# Altium project Modbus-HUB.PrjPcb (part 3 of 3)
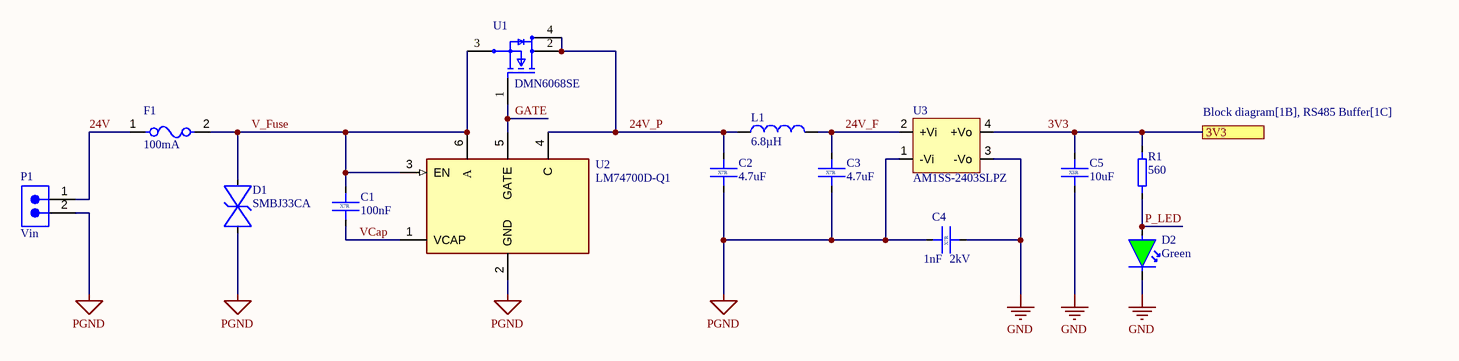
[diagram p4: PSU.SchDoc]

## Sheet PSU.SchDoc: POWER SUPPLY (continued)

### Library data of the parts (continued)
U1 = DMN6068SE-13: N-Channel 60 V 68 mOhm Surface Mount Enhancement Mode Mosfet - SOT-223-3; Manufacturer: Diodes; Package Body Material: Plastic; Transistor Element Material: SILICON; Number of Elements: 1; Time @ Peak Reflow Temperature-Max (s): 40s; Additional Feature: HIGH RELIABILITY; Avalanche Energy Rating (Eas): 37.5mJ; Case Connection: DRAIN; Drain Current-Max (Abs) (ID): 5.6A; Drain Current-Max (ID): 4.1A; Drain-source On Resistance-Max: 68mR; DS Breakdown Voltage-Min: 60V; FET Technology: METAL-OXIDE SEMICONDUCTOR; Power Dissipation-Max (Abs): 3.7W; Pulsed Drain Current-Max (IDM): 20.8A; Transistor Application: SWITCHING; JEDEC-95 Code: TO-261AA; Qualification Status: Not Qualified; Drain to Source Resistance: 68mΩ; Element Configuration: Single; Fall Time: 8.7ns; Gate to Source Voltage (Vgs): 20V; Input Capacitance: 502pF; Value: 68mΩ; Rise Time: 10.8ns; Turn-Off Delay Time: 11.9ns; Turn-On Delay Time: 3.6ns; Supplier: TME; Supplier Part Number: DMN6068SE-13; Manufacturer Part Number: DMN6068SE-13; RoHS: Yes; Category: MOSFETs; Stock: 3135; Pricing: 1=0,655, 10=0,425, 50=0,331, 100=0,291, 200=0,252, 250=0,239, 400=0,213, 500=0,2, 1000=0,161 (EUR); Pins: 4; Package Shape: Rectangular; Terminal Finish: Tin; Max Operating Temperature: 150°C; JESD-609 Code: e3; JESD-30 Code: R-PDSO-G4; Moisture Sensitivity Level: 1; Package Style: SMALL OUTLINEMeter; Peak Reflow Temperature (Cel): 260°C; Surface Mount: Yes; Terminal Form: Gull Wing; Terminal Position: DUAL; Polarity/Channel Type: N-CHANNEL; Operating Mode: ENHANCEMENT MODE; RoHS Compliant: Yes; Reach SVHC Compliant: No; ComponentLink1URL: https://datasheet.ciiva.com:443/pdfs/VipMasterIC/IC/DIOD/DIODS20377/DIODS20377-1.pdf?src-supplier=IHS+Markit; ComponentLink1Description: https://datasheet.ciiva.com:443/pdfs/VipMasterIC/IC/DIOD/DIODS20377/DIODS20377-1.pdf?src-supplier=IHS+Markit; ComponentLink2URL: https://datasheet.ciiva.com/11176/ds32033-11176546.pdf?src-supplier=Avnet; ComponentLink2Description: https://datasheet.ciiva.com/11176/ds32033-11176546.pdf?src-supplier=Avnet; ComponentLink3URL: https://datasheet.ciiva.com/935/ds32033-935232.pdf?src-supplier=Digikey; ComponentLink3Description: https://datasheet.ciiva.com/935/ds32033-935232.pdf?src-supplier=Digikey; ComponentLink4URL: https://datasheet.ciiva.com/8115/ds32033-8115611.pdf?src-supplier=Avnet; ComponentLink4Description: https://datasheet.ciiva.com/8115/ds32033-8115611.pdf?src-supplier=Avnet; Supplier 1: TME; Supplier Part Number 1: DMN6068SE-13; Case/Package: SOT-223; China RoHS: Non-Compliant; Contact Plating: Tin; Continuous Drain Current (ID): 4.1A; Drain to Source Breakdown Voltage: 60V; Drain to Source Voltage (Vdss): 60V; Height: 1.65mm; Lead Free: Lead Free; Length: 6.7mm; Lifecycle Status: Production; Max Power Dissipation: 3.7W; Min Breakdown Voltage: 60V; Min Operating Temperature: -55°C; Mounting Technology: Surface Mount; Number of Channels: 1; Number of Terminals: 4; Power Dissipation: 3.7W; Radiation Hardening: No; Rds On Max: 68mΩ; REACH SVHC: No; Schedule B: 8541290080, 8541290080|8541290080, 8541290080|8541290080|8541290080, 8541290080|8541290080|8541290080|8541290080; Weight: 7.994566mg; Width: 3.7mm; ComponentLink5URL: https://datasheet.octopart.com:443/DMN6068SE-13-Diodes-Inc.-datasheet-46751422.pdf?src-supplier=IHS; ComponentLink5Description: https://datasheet.octopart.com:443/DMN6068SE-13-Diodes-Inc.-datasheet-46751422.pdf?src-supplier=IHS; ComponentLink6URL: https://datasheet.octopart.com/DMN6068SE-13-Diodes-Inc.-datasheet-12556103.pdf; ComponentLink6Description: https://datasheet.octopart.com/DMN6068SE-13-Diodes-Inc.-datasheet-12556103.pdf; ComponentLink7URL: https://sigma.octopart.com:443/138895852/technical_drawing/Diodes-Inc.-DMN6068SE-13.pdf?src-supplier=Diodes+Inc+SCT; ComponentLink7Description: https://sigma.octopart.com:443/138895852/technical_drawing/Diodes-Inc.-DMN6068SE-13.pdf?src-supplier=Diodes+Inc+SCT; ComponentLink8URL: https://datasheet.octopart.com:443/DMN6068SE-13-Diodes-Inc.-datasheet-101745846.pdf?src-supplier=Future+Electronics; ComponentLink8Description: https://datasheet.octopart.com:443/DMN6068SE-13-Diodes-Inc.-datasheet-101745846.pdf?src-supplier=Future+Electronics; ComponentLink9URL: https://datasheet.octopart.com:443/DMN6068SE-13-Diodes-Inc.-datasheet-10884877.pdf?src-supplier=Arrow+Electronics; ComponentLink9Description: https://datasheet.octopart.com:443/DMN6068SE-13-Diodes-Inc.-datasheet-10884877.pdf?src-supplier=Arrow+Electronics; ComponentLink10URL: https://datasheet.octopart.com:443/DMN6068SE-13-Diodes-Inc.-datasheet-14188552.pdf?src-supplier=iiiC; ComponentLink10Description: https://datasheet.octopart.com:443/DMN6068SE-13-Diodes-Inc.-datasheet-14188552.pdf?src-supplier=iiiC; ComponentLink11URL: http://sigma.octopart.com:80/15540767/rohs_statement/Diodes-Inc.-DMN6068SE-13.pdf?src-supplier=Compliance+Statements; ComponentLink11Description: http://sigma.octopart.com:80/15540767/rohs_statement/Diodes-Inc.-DMN6068SE-13.pdf?src-supplier=Compliance+Statements
U2 = LM74700QDBVRQ1: Power Supply Support Circuit, Fixed, 1 Channel, PDSO6; Manufacturer: Texas Instrument; Manufacturer Part Number: LM74700QDBVRQ1; LCSC: C2941042; Supplier 1: Mouser; Supplier Part Number 1: 595-LM74700DDFEVM; Supplier: Mouser; Supplier Part Number: 595-LM74700QDBVRQ1; RoHS: Yes; Category: Power Management ICs; Stock: 15340; Throw Configuration: POWER SUPPLY SUPPORT CIRCUIT; RoHS Compliant: Yes; Reach SVHC Compliant: Yes; ComponentLink1URL: https://www.ti.com:443/lit/ds/symlink/lm74700-q1.pdf?src-supplier=IHS+Markit; ComponentLink1Description: https://www.ti.com:443/lit/ds/symlink/lm74700-q1.pdf?src-supplier=IHS+Markit; ComponentLink2URL: http://www.ti.com/general/docs/suppproductinfo.tsp?distId=10&amp;gotoUrl=http%3A%2F%2Fwww.ti.com%2Flit%2Fgpn%2Flm74700-q1&src-supplier=Digikey; ComponentLink2Description: http://www.ti.com/general/docs/suppproductinfo.tsp?distId=10&amp;gotoUrl=http%3A%2F%2Fwww.ti.com%2Flit%2Fgpn%2Flm74700-q1&src-supplier=Digikey
U3 = AM1SS-2403SLPZ: DC-DC Unregulated Power Supply Module, 1 Output, 1W, Hybrid; Manufacturer: Aimtec; Approvals: EN, IEC, UL; Efficiency: 84%; Max Supply Voltage: 26.4V; Max Output current: 303mA; Max Output Voltage: 3.63V; Min Input Voltage: 21.6V; Min Output Voltage: 2.97V; Nominal Supply Voltage: 24V; Nominal Output Voltage: 3.3V; Number of Circuits: 1; Supplier: TME; Supplier Part Number: AM1SS-2403SLPZ; Manufacturer Part Number: AM1SS-2403SLPZ; RoHS: Compliant; Category: Power Supply Modules; Stock: 9; Pricing: 1=1,58, 11=1,48, 22=1,38, 44=1,29 (EUR); Case/Package: SIP; Composition: Hybrid; Export Control Classification Number (ECCN) Code: EAR99; Height - Seated (Max): 10.7mm; Introduction Date: 2024-08-23; Length: 11.6mm; Lifecycle Status: Production; Max Operating Temperature: 105°C; Max Output Power: 1W; Min Operating Temperature: -40°C; Number of Outputs: 1; Number of Terminals: 4; REACH SVHC: Unaffected; Terminal Pitch: 2.54mm; Width: 6mm; ComponentLink1URL: https://datasheet.octopart.com:443/AM1SS-2403SLPZ-Aimtec-datasheet-183635713.pdf?src-supplier=Newark; ComponentLink1Description: https://datasheet.octopart.com:443/AM1SS-2403SLPZ-Aimtec-datasheet-183635713.pdf?src-supplier=Newark

## Assembly variants
Production: not fitted P101 P104 R301 R303 R306 R308 R401 R403 R406 R408 R501 R503 R506 R508 R601 R603 R606 R608
Production (RJ Only): not fitted P101 P302 P402 P502 P602 R601 R603 R606 R608
Production (Terminal Only): not fitted P101 P104 P301 P401 P501 P601 R301 R303 R306 R308 R401 R403 R406 R408 R501 R503 R506 R508 R601 R603 R606 R608